# EAGLE design PowerNest (EAGLE 9.3.2)
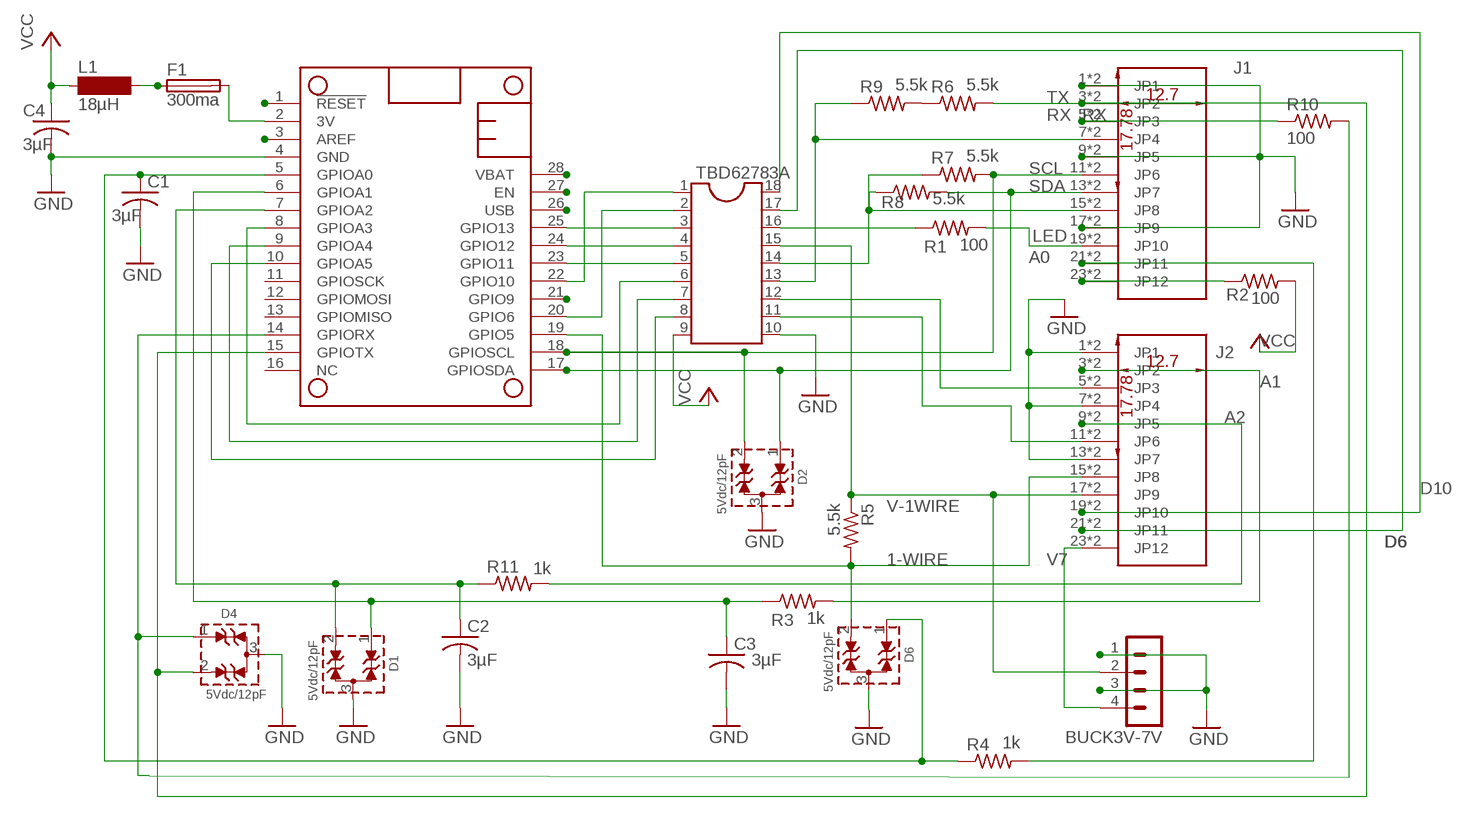
[diagram p0: schematic, sheet 1]

## Parts
BUCK3V-7V  MA04-1  [MA04-1]
C1  3µF  C-USC1206K  [C1206K]
C2  3µF  C-USC1206K  [C1206K]
C3  3µF  C-USC1206K  [C1206K]
C4  3µF  C-USC1206K  [C1206K]
D1  5Vdc/12pF  WE-TVS_SOT23-3L_824022  [WE-TVS_SOT23-3L]
D2  5Vdc/12pF  WE-TVS_SOT23-3L_824022  [WE-TVS_SOT23-3L]
D4  5Vdc/12pF  WE-TVS_SOT23-3L_824022  [WE-TVS_SOT23-3L]
D6  5Vdc/12pF  WE-TVS_SOT23-3L_824022  [WE-TVS_SOT23-3L]
F1  300ma  TE5  [TE5]
FEATHER  FEATHERWING_NODIM  [FEATHERWING_DIM]
J1  MC000008B  [CONNECTED]
J2  MC000008B  [CONNECTED]
L1  18µH  BS11  [BS11]
R1  100  R-US_R1206  [R1206]
R2  100  R-US_R1206  [R1206]
R3  1k  R-US_R1206  [R1206]
R4  1k  R-US_R1206  [R1206]
R5  5.5k  R-US_R1206  [R1206]
R6  5.5k  R-US_R1206  [R1206]
R7  5.5k  R-US_R1206  [R1206]
R8  5.5k  R-US_R1206  [R1206]
R9  5.5k  R-US_R1206  [R1206]
R10  100  R-US_R1206  [R1206]
R11  1k  R-US_R1206  [R1206]
TBD62783A  DIL18S  [SOCKET-18]

## Nets
1-WIRE: D6.2(I/O2) FEATHER.19(GPIO5) J2.15(JP8) J2.16(JP8) R5.2
3V: F1.2 FEATHER.2(3V)
A0: J1.21(JP11) J1.22(JP11) R4.2
A1: J2.3(JP2) J2.4(JP2) R3.2
A2: J2.9(JP5) J2.10(JP5) R11.2
D6: J2.21(JP11) J2.22(JP11) TBD62783A.17
D10: J2.19(JP10) J2.20(JP10) TBD62783A.18
GND: BUCK3V-7V.1 BUCK3V-7V.3 C1.2 C2.2 C3.2 C4.2 D1.3(GND) D2.3(GND) D4.3(GND) D6.3(GND) FEATHER.4(GND) J1.1(JP1) J1.2(JP1) J1.9(JP5) J1.10(JP5) J1.17(JP9) J1.18(JP9) J2.1(JP1) J2.2(JP1) J2.7(JP4) J2.8(JP4) J2.13(JP7) J2.14(JP7) TBD62783A.10
LED: J1.19(JP10) J1.20(JP10) R1.2
N$1: FEATHER.25(GPIO13) TBD62783A.3
N$2: FEATHER.8(GPIOA3) TBD62783A.6
N$3: FEATHER.24(GPIO12) TBD62783A.4
N$4: FEATHER.23(GPIO11) TBD62783A.5
N$5: FEATHER.9(GPIOA4) TBD62783A.7
N$6: FEATHER.10(GPIOA5) TBD62783A.8
N$7: F1.1 L1.2
N$8: J1.15(JP8) J1.16(JP8) R7.1 R8.1 TBD62783A.14
N$9: J1.7(JP4) J1.8(JP4) R9.1 TBD62783A.13
N$10: C3.1 D1.1(I/O1) FEATHER.6(GPIOA1) R3.1
N$11: C2.1 D1.2(I/O2) FEATHER.7(GPIOA2) R11.1
N$12: R6.1 R9.2
N$15: J2.5(JP3) J2.6(JP3) TBD62783A.12
N$16: J2.11(JP6) J2.12(JP6) TBD62783A.11
N$18: FEATHER.27(EN)
N$19: D4.1(I/O1) FEATHER.14(GPIORX) R10.2
N$20: FEATHER.3(AREF)
N$21: FEATHER.1(!RESET)
N$22: R1.1 TBD62783A.16
N$24: J1.23(JP12) J1.24(JP12) R2.1
N$27: C1.1 D6.1(I/O1) FEATHER.5(GPIOA0) R4.1
N$45: FEATHER.22(GPIO10) TBD62783A.1
N$46: FEATHER.21(GPIO9)
N$47: FEATHER.20(GPIO6) TBD62783A.2
RX: J1.5(JP3) J1.6(JP3) R10.1
SCL: D2.2(I/O2) FEATHER.18(GPIOSCL) J1.11(JP6) J1.12(JP6) R7.2
SDA: D2.1(I/O1) FEATHER.17(GPIOSDA) J1.13(JP7) J1.14(JP7) R8.2
TX: D4.2(I/O2) FEATHER.15(GPIOTX) J1.3(JP2) J1.4(JP2) R6.2
USB: FEATHER.26(USB)
V7: BUCK3V-7V.4 J2.23(JP12) J2.24(JP12)
V-1WIRE: BUCK3V-7V.2 J2.17(JP9) J2.18(JP9) R5.1 TBD62783A.15
VBAT: FEATHER.28(VBAT)
VCC: C4.1 L1.1 R2.2 TBD62783A.9
Unconnected: FEATHER.11(GPIOSCK) FEATHER.12(GPIOMOSI) FEATHER.13(GPIOMISO) FEATHER.16(NC)

## Library data of the parts
BUCK3V-7V = con-lstb:MA04-1: PIN HEADER; OC_FARNELL: unknown; OC_NEWARK: unknown
C1-C4 = adafruit:C-US: CAPACITOR, American symbol
D1 D2 D4 D6 = EMCComponents (rev19b):WE-TVS_SOT23-3L_824022: WE-TVS TVS Diode – Standard Series Characteristics Fast turn-on Low clamping voltage High ESD withstand voltage Uni- or bidirectional protection Small package Epoxy flame resistant UL94 V-0 Applications DC power supply USB Power Delivery (PD) Headsets and accessories PDAs Digital cameras MP3-Player Touch Panels Notebooks ESD, EFT and Surge Protection ESD protection in accordance with EN 61000-4-2 – 8 kV contact discharge – 15 kV air discharge Application Notes ANP024 The USB Interface from EMC Point of View <https://katalog.we-online.de/media/images/v2/Family_WE-TVS_Standard.jpg> Details see: https://katalog.we-online.de/en/pbs/WE-TVS/82402374?m Updated by Dan Xu 2014-07-11 2014 (C) Wurth Elektronik; WE-NUMBER: 824022
F1 = fuse:TE5: FUSE Wickmann; OC_FARNELL: unknown; OC_NEWARK: unknown
FEATHER = adafruit:FEATHERWING
J1 J2 = MC000008:MC000008B
L1 = inductor-neosid:BS: INDUCTOR nominal inductance, magnetically screened; OC_FARNELL: unknown; OC_NEWARK: unknown
R1-R11 = rcl:R-US_: RESISTOR, American symbol; SPICEPREFIX: R
TBD62783A = ic-package:DIL18: Dual In Line / Socket

## Net classes
0 default: width 0.175 mm

## Board
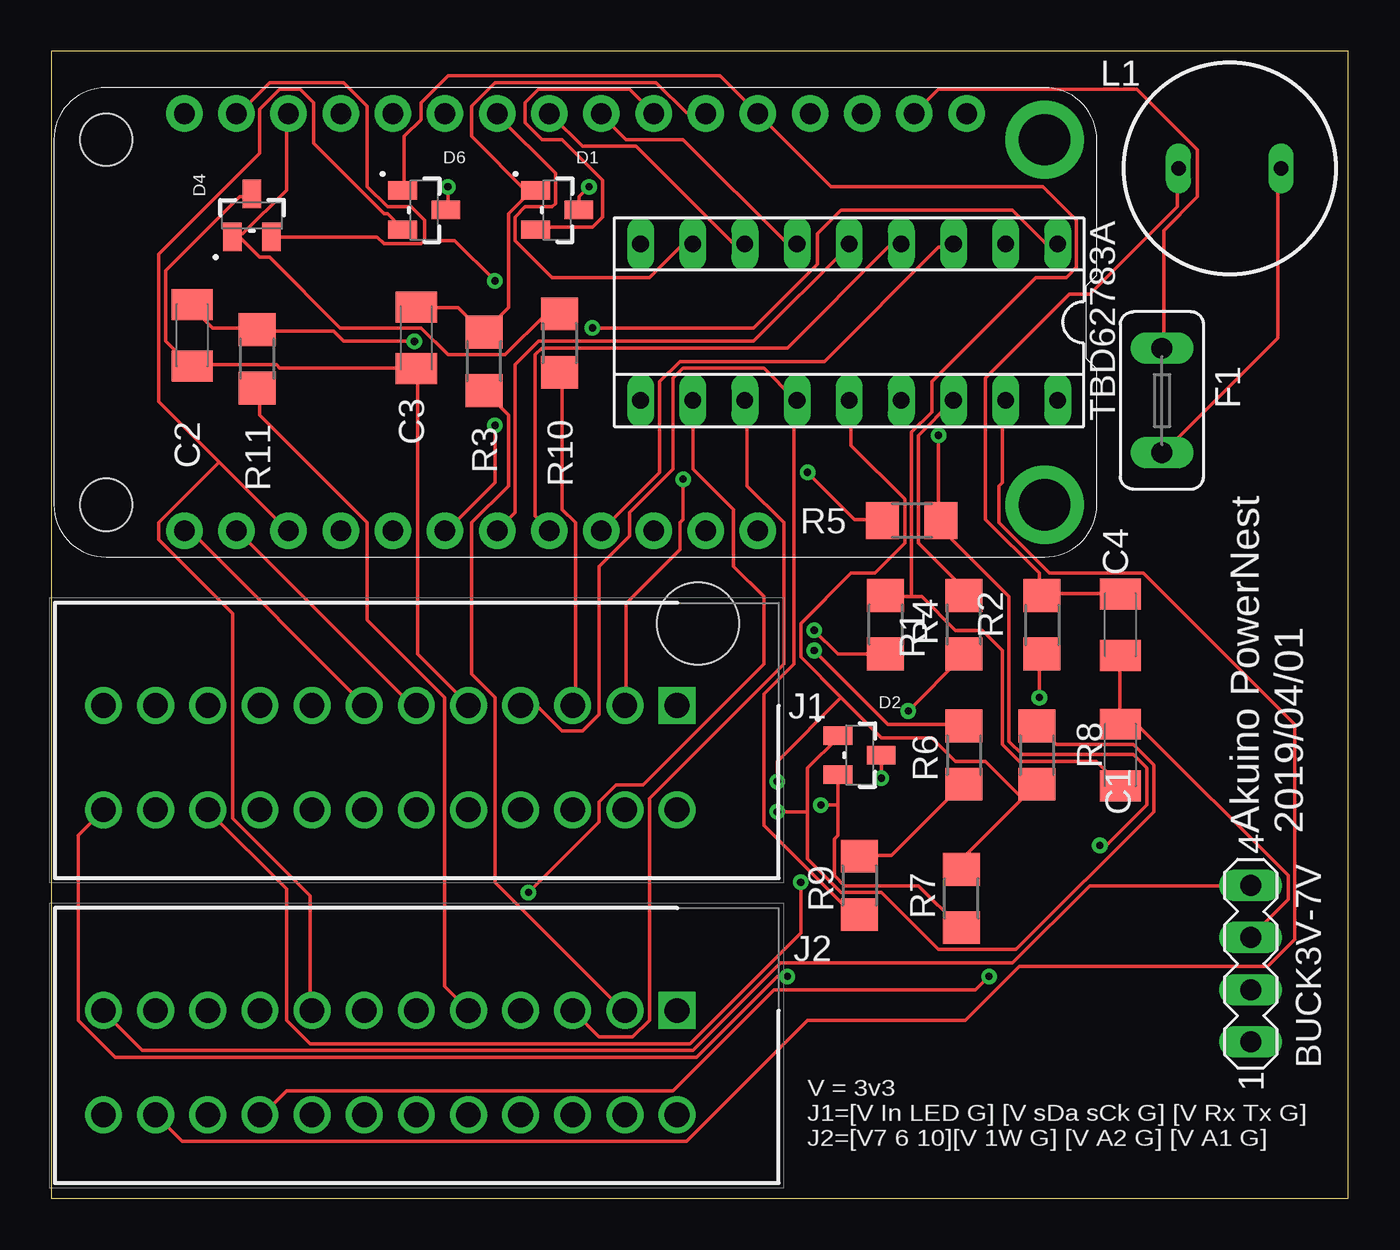
[diagram p1: board, top side]
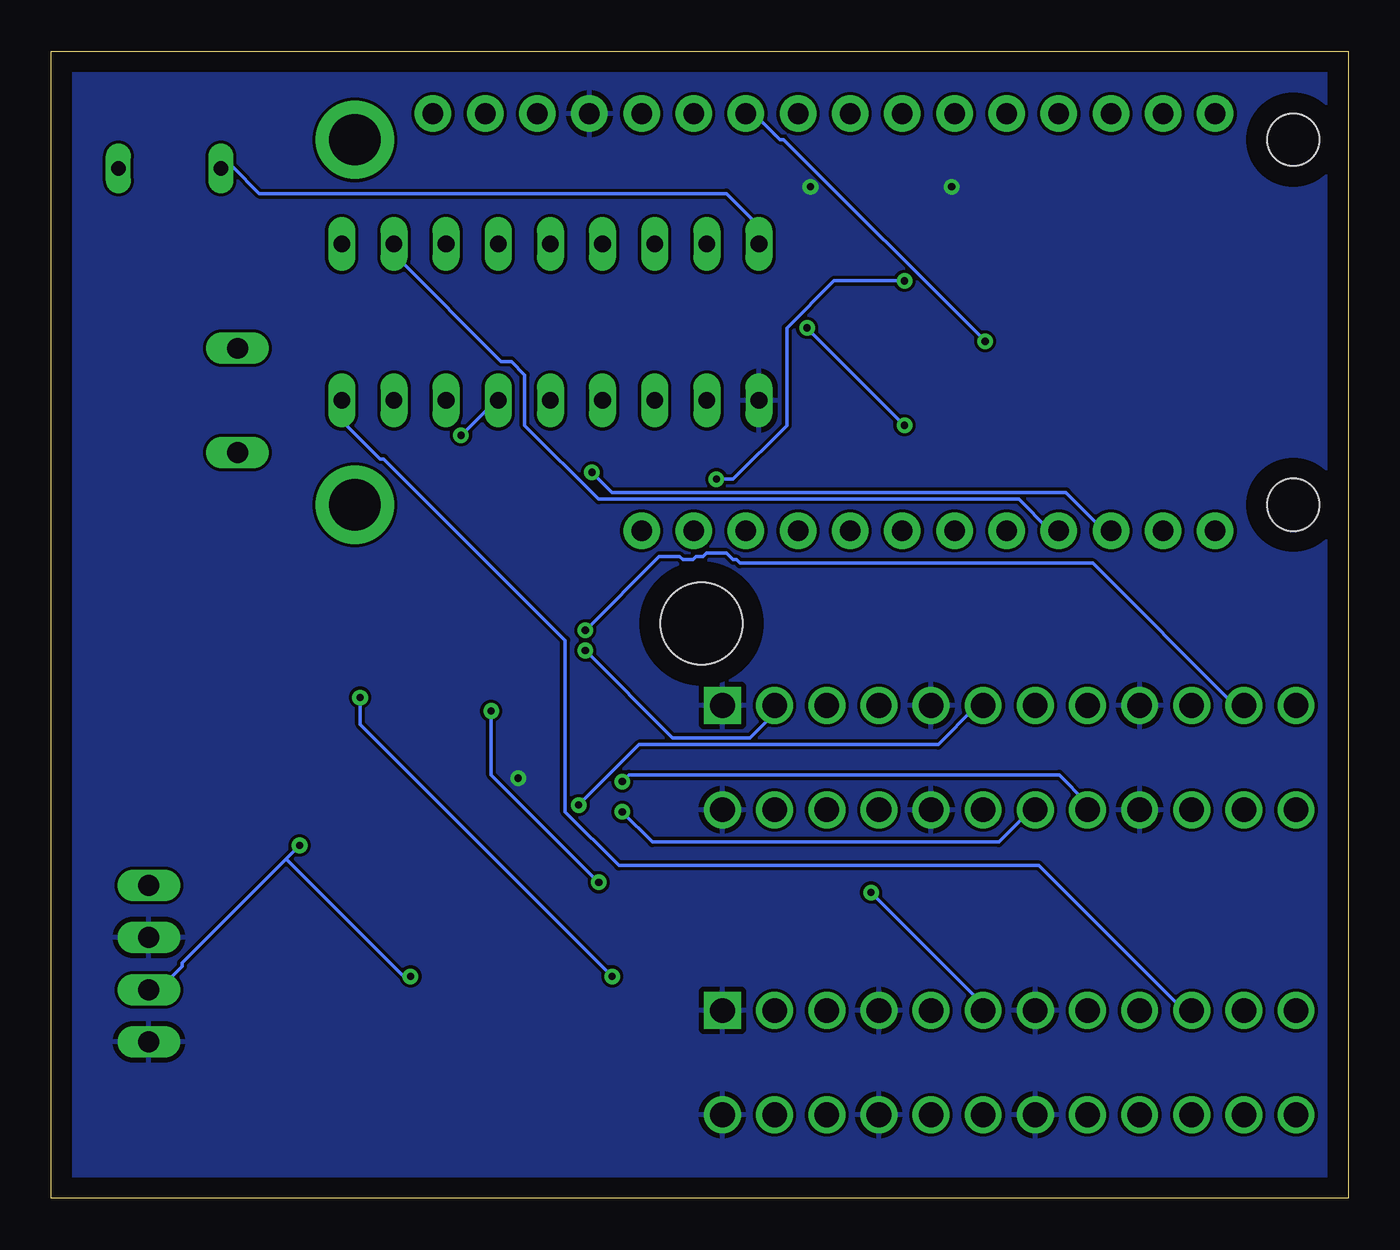
[diagram p2: board, bottom side, seen from below]

Size 63.17 x 55.87 mm. Coordinates in mm from the lower left corner, seen from the top.
Outline: 0,0 63.17,0 63.17,55.87 0,55.87 0,0
Copper layers (1*16): Top 0.035mm / dielectric 1.5mm / Bottom 0.035mm
Design rules "default": minimum track width 6mil, minimum drill 0.35mm, track to track 6mil, track to pad 6mil, pad to pad 6mil, via to via 6mil, smd to smd 6mil, copper to edge 40mil, drill to drill 6mil, minimum pad ring 10mil, minimum via ring 8mil, stop-mask expansion 4mil, vias tented up to drill 0mil, thermal gap 10mil
Holes 4 mm at 31.5,28

### Footprints (pad centres in the part's own frame; a part is rotated, then mirrored left to right if it is on the bottom)
MA04-1 = drill 1.016 long: 1 -3.81,0; 2 -1.27,0; 3 1.27,0; 4 3.81,0
C1206K = smd 1.5 x 2: 1 -1.5,0; 2 1.5,0
WE-TVS_SOT23-3L = smd 1.4 x 0.9: 1 -1.05,0.95; 2 -1.05,-0.95; 3 1.05,0
TE5 = drill 1.016 long: 1 -2.54,0; 2 2.54,0
FEATHERWING_DIM = drill 1 pad 1.778: 1 6.35,1.27; 2 8.89,1.27; 3 11.43,1.27; 4 13.97,1.27; 5 16.51,1.27; 6 19.05,1.27; 7 21.59,1.27; 8 24.13,1.27; 9 26.67,1.27; 10 29.21,1.27; 11 31.75,1.27; 12 34.29,1.27; 13 36.83,1.27; 14 39.37,1.27; 15 41.91,1.27; 16 44.45,1.27; 17 44.45,21.59; 18 41.91,21.59; 19 39.37,21.59; 20 36.83,21.59; 21 34.29,21.59; 22 31.75,21.59; 23 29.21,21.59; 24 26.67,21.59; 25 24.13,21.59; 26 21.59,21.59; 27 19.05,21.59; 28 16.51,21.59 | drill 2.5 pad 3.81: P$1 2.54,20.32; P$2 2.54,2.54 | hole 2.54: 48.26,20.32; 48.26,2.54
CONNECTED = drill 1.2 pad 1.8 square: 1 0,0 | drill 1.2 pad 1.8: 2 0,5.08; 3 2.54,0; 4 2.54,5.08; 5 5.08,0; 6 5.08,5.08; 7 7.62,0; 8 7.62,5.08; 9 10.16,0; 10 10.16,5.08; 11 12.7,0; 12 12.7,5.08; 13 15.24,0; 14 15.24,5.08; 15 17.78,0; 16 17.78,5.08; 17 20.32,0; 18 20.32,5.08; 19 22.86,0; 20 22.86,5.08; 21 25.4,0; 22 25.4,5.08; 23 27.94,0; 24 27.94,5.08
BS11 = drill 0.7 long: 1 -2.5,0; 2 2.5,0
R1206 = smd 1.6 x 1.803: 1 -1.422,0; 2 1.422,0
SOCKET-18 = drill 0.813 long: 1 -10.16,-3.81; 2 -7.62,-3.81; 3 -5.08,-3.81; 4 -2.54,-3.81; 5 0,-3.81; 6 2.54,-3.81; 7 5.08,-3.81; 8 7.62,-3.81; 9 10.16,-3.81; 10 10.16,3.81; 11 7.62,3.81; 12 5.08,3.81; 13 2.54,3.81; 14 0,3.81; 15 -2.54,3.81; 16 -5.08,3.81; 17 -7.62,3.81; 18 -10.16,3.81

### Placement (x,y rotation side)
BUCK3V-7V  58.42,11.43 90 top
C1  52.07,21.59 90 top
C2  6.86,42.04 270 top
C3  17.78,41.91 270 top
C4  52.07,27.94 270 top
D1  24.64,48.13 0 top
D2  39.37,21.59 0 top
D4  9.78,47.88 90 top
D6  18.16,48.13 0 top
F1  54.1,38.86 90 top
FEATHER  50.93,54.1 180 top
J1  30.48,24 180 top
J2  30.48,9.14 180 top
L1  57.4,50.16 0 top
R1  44.45,27.94 270 top
R2  48.26,27.94 90 top
R3  21.08,40.77 270 top
R4  40.64,27.94 270 top
R5  41.91,33.02 180 top
R6  44.45,21.59 90 top
R7  44.32,14.61 270 top
R8  48.01,21.59 90 top
R9  39.37,15.24 90 top
R10  24.77,41.66 90 top
R11  10.03,40.89 270 top
TBD62783A  38.86,42.67 180 top

### Tracks (layer width: path | path; a pad name or v marks a point on that pad's centre or on a via)
1-WIRE  (via drill 0.35)
  Top 0.175: 8.19,35.85 11.46,32.58 FEATHER.19 | 8.19,35.85 5.24,38.8 5.24,46 10.15,50.91 10.15,53.04 11.13,54.02 12.11,54.02 12.77,53.37 12.77,51.4 16.21,47.96 16.37,47.96 17.02,47.31 D6.2 | v36.83,35.36 39.12,33.07 40.43,33.07 R5.2 | 8.19,35.85 5.24,32.9 5.24,32.09 8.84,28.48 8.84,18.5 12.61,14.73 12.61,9.17 J2.15
  Bottom 0.175: v36.83,35.36 35.85,34.38 13.75,34.38 11.95,32.58 11.62,32.58 FEATHER.19
3V
  Top 0.175: F1.2 54.19,41.42 54.19,47.15 55.82,48.78 55.82,51.07 52.88,54.02 43.22,54.02 42.07,52.88 FEATHER.2
A0  (via drill 0.35)
  Top 0.175: v37.16,27.66 38.31,26.52 40.6,26.52 R4.2
  Bottom 0.175: v37.16,27.66 33.56,31.27 32.58,31.27 32.41,31.1 31.92,31.1 31.76,31.27 31.43,31.27 31.27,31.43 30.29,31.43 29.96,31.1 29.79,31.1 29.63,30.94 12.44,30.94 5.57,24.06 5.24,24.06 J1.21
A1
  Top 0.175: R3.2 21.12,39.29 22.26,38.14 22.26,34.7 20.46,32.9 20.46,25.54 21.61,24.39 21.61,15.39 27.83,9.17 J2.3
A2
  Top 0.175: R11.2 10.15,39.45 10.15,38.14 15.39,32.9 15.39,28.16 19.15,24.39 19.15,10.31 20.3,9.17 J2.9
D6
  Top 0.175: TBD62783A.17 46.33,38.8 46.33,34.87 46.16,34.7 46.16,32.9 48.62,30.45 53.2,30.45 60.57,23.08 60.57,12.61 59.26,11.29 47.15,11.29 44.53,8.68 36.83,8.68 30.94,2.78 6.38,2.78 5.24,3.93 J2.22
D10
  Bottom 0.175: TBD62783A.18 48.95,38.8 48.95,37.81 47.15,36.01 46.98,36.01 38.14,27.17 38.14,18.83 35.52,16.21 15.06,16.21 8.02,9.17 7.69,9.17 J2.19
GND  (via drill 0.35)
  Top 0.175: D4.3 9.66,48.78 9.17,48.78 5.57,45.18 5.57,41.74 6.71,40.6 C2.2 6.88,40.6 10.97,40.6 11.13,40.43 17.68,40.43 C3.2 17.84,40.27 17.84,26.52 20.3,24.06 J1.9 | 52.22,23.25 C1.2 | v19.32,49.27 19.32,48.29 D6.3 | v26.19,49.27 25.7,48.78 25.7,48.29 D1.3 | v40.43,20.46 40.43,21.45 D2.3 | 52.88,23.08 52.22,23.08 C1.2 | C1.2 52.06,23.25 52.06,26.36 C4.2 | 52.88,23.08 60.24,15.71 60.24,14.57 58.44,12.77 BUCK3V-7V.3 | 52.88,23.08 C1.2
  pour Bottom: 0,55.88 63.5,55.88 63.5,0 0,0
LED  (via drill 0.35)
  Top 0.175: v41.74,23.74 44.36,26.36 R1.2 | v36.51,15.39 36.51,12.93 31.1,7.53 12.61,7.53 11.46,8.68 11.46,15.06 7.69,18.83 J1.20
  Bottom 0.175: v41.74,23.74 41.74,20.63 v36.51,15.39
N$1
  Top 0.175: TBD62783A.3 43.87,46.33 43.22,46.33 37.65,40.76 30.61,40.76 29.63,39.78 29.63,35.36 26.85,32.58 FEATHER.25
N$2
  Top 0.175: TBD62783A.6 36.18,46.49 35.85,46.49 30.78,51.57 27.99,51.57 26.85,52.71 FEATHER.8
N$3
  Top 0.175: TBD62783A.4 41.25,46.33 40.76,46.33 35.85,41.42 23.9,41.42 23.57,41.09 23.57,33.23 24.23,32.58 FEATHER.24
N$4
  Top 0.175: TBD62783A.5 38.8,46.33 34.21,41.74 23.74,41.74 22.59,40.6 22.59,33.4 21.77,32.58 FEATHER.23
N$5
  Top 0.175: TBD62783A.7 33.72,46.49 33.23,46.49 28.48,51.24 25.86,51.24 24.39,52.71 FEATHER.9
N$6
  Top 0.175: TBD62783A.8 31.1,46.33 30.61,46.33 29.14,44.85 24.39,44.85 22.59,46.65 22.59,47.8 23.08,48.29 24.39,48.29 24.55,48.45 24.55,49.93 21.77,52.71 FEATHER.10
N$7
  Top 0.175: L1.2 59.75,50.09 59.75,41.91 54.19,36.34 F1.1
N$8  (via drill 0.35)
  Top 0.175: 47.31,19.48 47.96,20.14 R8.1 47.31,19.48 | 47.31,19.48 44.36,16.53 44.36,16.04 R7.1 | 38.47,24.39 40.43,22.43 42.89,22.43 44.03,21.28 45.51,21.28 47.31,19.48 | 38.47,24.39 36.51,26.36 36.51,27.99 38.96,30.45 40.11,30.45 41.58,31.92 41.58,34.05 38.96,36.67 38.96,38.8 TBD62783A.14 | v35.36,20.3 35.36,21.28 38.47,24.39
  Bottom 0.175: v35.36,20.3 35.03,20.63 14.08,20.63 12.77,19.32 12.77,18.99 J1.16
N$9
  Top 0.175: R9.1 39.29,13.91 38.96,13.91 34.7,18.17 34.7,24.55 36.18,26.03 36.18,38.8 TBD62783A.13 36.18,38.96 34.7,40.43 30.78,40.43 30.29,39.94 30.29,35.52 28.16,33.4 28.16,32.25 26.68,30.78 26.68,23.57 25.86,22.75 24.88,22.75 23.74,23.9 22.92,23.9 J1.7
N$10
  Top 0.175: 23.25,48.95 23.57,48.95 D1.1 23.25,48.95 | 23.25,48.95 22.26,47.96 22.26,43.38 21.12,42.23 R3.1 20.95,42.23 19.81,43.38 17.84,43.38 C3.1 | 23.25,48.95 20.46,51.73 20.46,53.2 21.61,54.35 29.47,54.35 30.94,52.88 31.76,52.88 FEATHER.6
N$11  (via drill 0.35)
  Top 0.175: C2.1 6.88,43.38 7.86,42.4 9.99,42.4 R11.1 10.15,42.23 13.75,42.23 14.24,41.74 v17.68,41.74 | D1.2 23.74,47.31 26.36,47.31 26.85,47.8 26.85,49.6 24.88,51.57 23.9,51.57 23.08,52.38 23.08,53.37 23.74,54.02 28.16,54.02 29.3,52.88 FEATHER.7
  Bottom 0.175: v17.68,41.74 27.5,51.57 27.66,51.57 28.81,52.71 29.3,52.71 FEATHER.7
N$12
  Top 0.175: R9.2 39.45,16.7 40.92,16.7 44.36,20.14 R6.1
N$15
  Top 0.175: TBD62783A.12 33.89,38.8 33.89,34.7 35.69,32.9 35.69,26.03 29.14,19.48 29.14,8.68 28.32,7.86 26.68,7.86 25.54,9 J2.5
N$16  (via drill 0.35)
  Top 0.175: v23.25,14.9 26.68,18.33 26.68,19.32 27.5,20.14 28.81,20.14 34.7,26.03 34.7,29.3 33.23,30.78 33.23,33.56 31.27,35.52 31.27,38.8 TBD62783A.11
  Bottom 0.175: v23.25,14.9 17.84,9.49 17.84,9.17 J2.11
N$19
  Top 0.175: 9,46.98 9.33,46.98 11.46,49.11 11.46,52.71 FEATHER.14 | 9,46.98 8.84,46.98 D4.1 9,46.98 | 9,46.98 10.15,45.84 10.64,45.84 14.08,42.4 18.01,42.4 19.32,41.09 22.1,41.09 24.06,43.05 24.72,43.05 R10.2
N$22
  Top 0.175: R1.1 44.36,29.47 44.36,29.79 42.23,31.92 42.23,37.16 43.87,38.8 TBD62783A.16
N$24  (via drill 0.35)
  Top 0.175: v35.85,10.8 35.36,10.8 31.43,6.88 3.11,6.88 1.31,8.68 1.31,17.68 2.46,18.83 J1.24 | v48.13,24.39 48.13,26.36 R2.1
  Bottom 0.175: v48.13,24.39 48.13,23.08 v35.85,10.8
N$27
  Top 0.175: 41.91,29.3 42.4,29.3 44.03,27.66 45.34,27.66 46.33,26.68 46.33,22.1 47.15,21.28 50.91,21.28 52.06,20.14 C1.1 | 41.91,29.3 40.76,29.3 R4.1 | D6.1 17.19,49.11 17.19,51.73 18.01,52.55 18.01,53.37 19.32,54.68 32.58,54.68 34.38,52.88 FEATHER.5 34.54,52.71 37.98,49.27 48.29,49.27 49.93,47.64 49.93,45.34 49.44,44.85 47.96,44.85 42.89,39.78 42.89,38.31 41.91,37.32 41.91,29.3
N$45  (via drill 0.35)
  Top 0.175: v26.36,42.4 34.21,42.4 37.32,45.51 37.32,46.98 38.47,48.13 46.82,48.13 48.45,46.49 48.95,46.49 TBD62783A.1 | v21.61,37.65 21.61,34.87 19.32,32.58 FEATHER.22
  Bottom 0.175: v21.61,37.65 v26.36,42.4
N$47
  Bottom 0.175: TBD62783A.2 46.33,46.33 46.33,45.84 41.25,40.76 40.76,40.76 40.11,40.11 40.11,37.65 36.51,34.05 16.04,34.05 14.57,32.58 14.24,32.58 FEATHER.20
RX
  Top 0.175: R10.1 24.88,40.11 24.88,33.56 25.54,32.9 25.54,24.06 J1.5
SCL  (via drill 0.35)
  Top 0.175: 38.31,19.15 38.31,17.68 38.14,17.52 38.14,15.71 38.63,15.22 42.23,15.22 44.2,13.26 R7.2 | 38.31,19.15 38.31,20.63 D2.2 | FEATHER.18 9.17,32.41 17.68,23.9 J1.11 | v37.49,19.15 38.31,19.15
  Bottom 0.175: v37.49,19.15 34.54,22.1 19.97,22.1 18.17,23.9 17.84,23.9 J1.11
SDA  (via drill 0.35)
  Top 0.175: 36.83,18.83 36.83,16.53 38.47,14.9 40.43,14.9 43.22,12.11 46.98,12.11 53.69,18.83 53.69,21.12 52.71,22.1 48.95,22.1 48.13,22.92 R8.2 | 36.83,18.83 36.83,20.95 38.31,22.43 D2.1 | FEATHER.17 6.55,32.41 6.88,32.41 15.22,24.06 J1.13 | v35.36,18.83 36.83,18.83
  Bottom 0.175: v35.36,18.83 33.89,17.35 17.02,17.35 15.39,18.99 J1.14
TX  (via drill 0.35)
  Top 0.175: 18.17,46.65 18.01,46.49 16.21,46.49 15.88,46.82 10.8,46.82 D4.2 | 18.17,46.65 18.17,47.64 17.52,48.29 16.37,48.29 15.39,49.27 15.39,53.2 14.24,54.35 10.64,54.35 9.17,52.88 FEATHER.15 | v37.16,26.68 40.76,23.08 44.36,23.08 R6.2 | 18.17,46.65 19.64,46.65 v21.61,44.69 | v30.78,35.03 30.78,33.07 30.61,32.9 30.61,31.59 27.99,28.98 27.99,24.06 J1.3
  Bottom 0.175: v37.16,26.68 32.9,22.43 29.14,22.43 27.99,23.57 27.99,23.9 J1.3 | v21.61,44.69 25.05,44.69 27.34,42.4 27.34,37.65 29.96,35.03 v30.78,35.03
V7
  Top 0.175: BUCK3V-7V.4 58.28,15.22 50.58,15.22 46.82,11.46 35.52,11.46 31.27,7.2 4.42,7.2 2.62,9 J2.23
V-1WIRE  (via drill 0.35)
  Top 0.175: v43.22,37.16 43.22,33.07 R5.1 43.38,32.9 43.38,32.58 46.65,29.3 46.65,22.26 47.31,21.61 52.71,21.61 53.37,20.95 53.37,19.15 51.4,17.19 v51.07,17.19 | 58.28,10.15 BUCK3V-7V.2 | J2.18 10.31,4.09 11.46,5.24 30.29,5.24 35.2,10.15 45.02,10.15 v45.67,10.8
  Bottom 0.175: v43.22,37.16 41.42,38.96 TBD62783A.15 | 51.73,16.53 56.8,11.46 56.8,11.29 57.79,10.31 58.28,10.31 BUCK3V-7V.2 | 51.73,16.53 v51.07,17.19 | v45.67,10.8 46,10.8 51.73,16.53
VCC
  Top 0.175: 48.29,29.3 R2.2 | L1.1 54.84,50.09 54.84,48.29 50.58,44.03 49.6,44.03 45.51,39.94 45.51,33.07 48.13,30.45 48.13,29.47 R2.2 | R2.2 48.29,29.47 52.06,29.47 C4.1
  Bottom 0.175: TBD62783A.9 28.81,46.49 28.81,47.47 30.29,48.95 53.04,48.95 54.35,50.26 54.84,50.26 L1.1

### Text on the board
tNames: Akuino PowerNest / 2019/04/01 | V = 3v3 / J1=[V In LED G] [V sDa sCk G] [V Rx Tx G] / J2=[V7 6 10][V 1W G] [V A2 G] [V A1 G]